# Altium project H21R4.PrjPcb
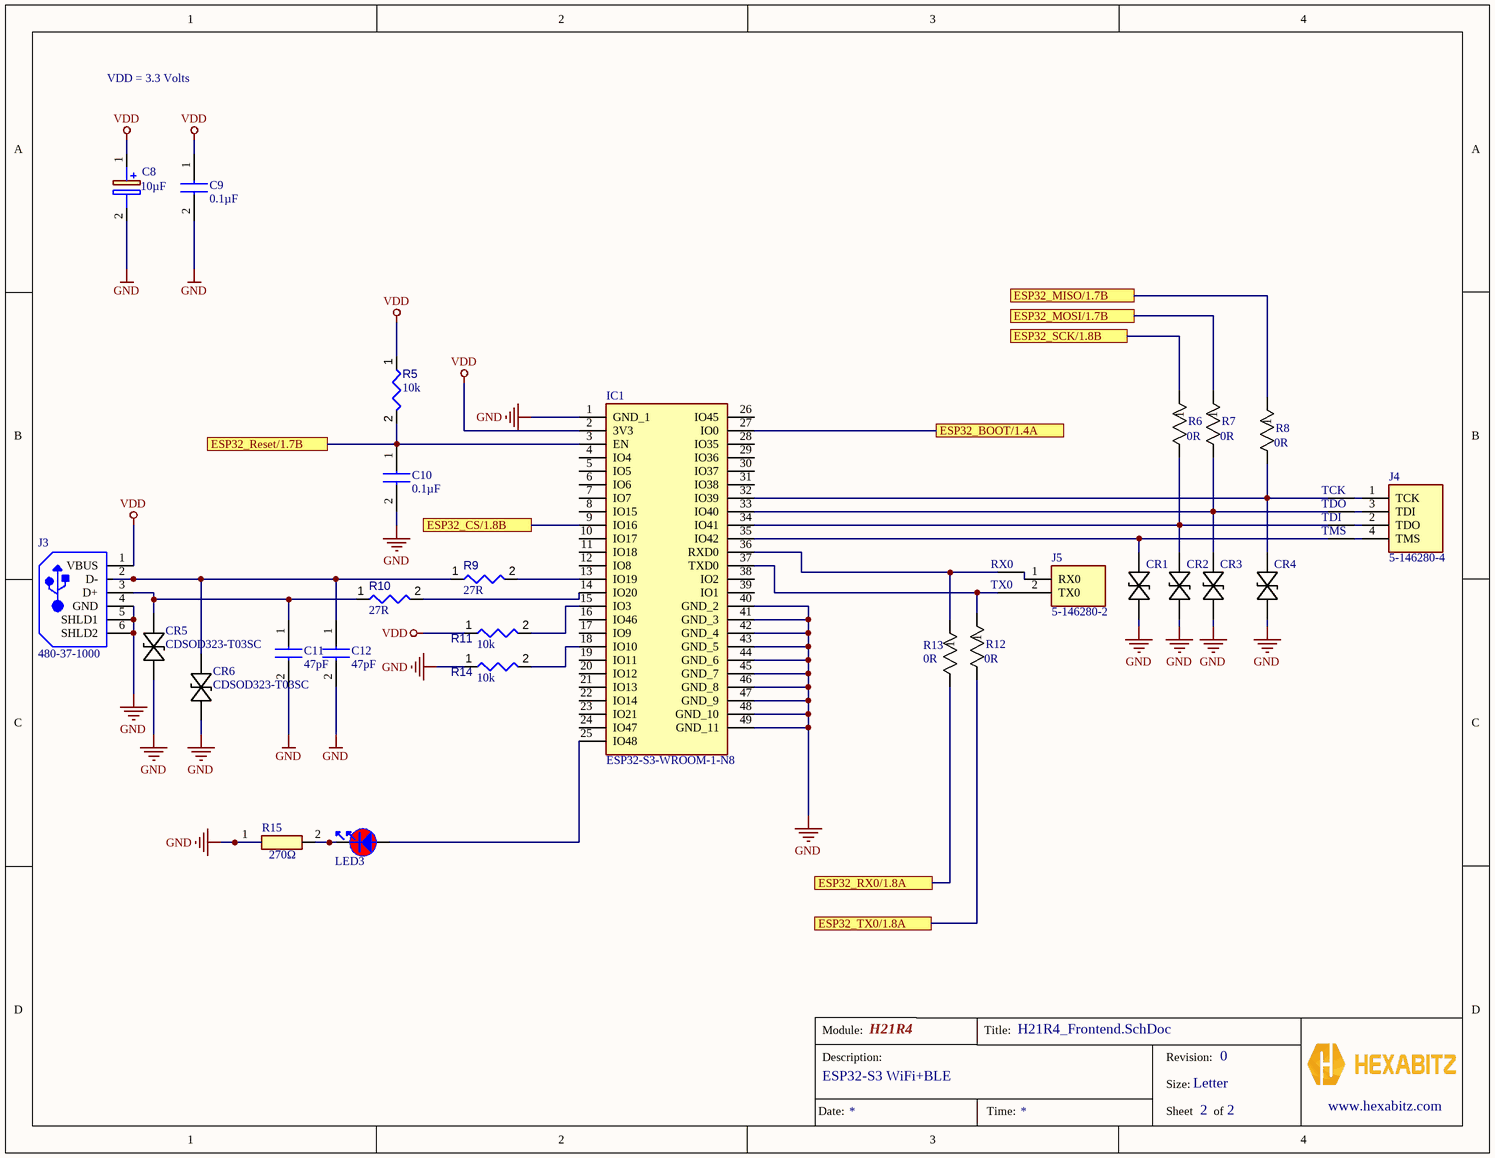
[diagram p0: H21R4_Frontend.SchDoc]
Module_Description: ESP32-S3 WiFi+BLE; Module_Name: H21R4; revision: 0
2 sheets, 73 parts. Net scope: flat (ports and power ports of the same name join across sheets).
Board file: H21R4.PcbDoc
Sheets:
  H21R4_Frontend.SchDoc
  H21R4_Backend.SchDoc

## Sheet H21R4_Frontend.SchDoc
size Letter; CompanyName: Hexabitz; DocumentNumber: 3; SheetNumber: 2; SheetTotal: 2

### Parts
C8  value 10µF  [CAPPM3528X210N]  (hidden comment: TPSB106K016R0500)
C9  value 0.1µF  [CAPC1608X87N]  (hidden comment: C0603C104K8RAC7867)
C10  value 0.1µF  [CAPC1608X87N]  (hidden comment: C0603C104K8RAC7867)
C11  value 47pF  [CAPC1608X90N]  (hidden comment: CL10C470JB8NNNC)
C12  value 47pF  [CAPC1608X90N]  (hidden comment: CL10C470JB8NNNC)
CR1  CDSOD323-T03SC  [SOD-323_BRN]  (value not drawn)
CR2  CDSOD323-T03SC  [SOD-323_BRN]  (value not drawn)
CR3  CDSOD323-T03SC  [SOD-323_BRN]  (value not drawn)
CR4  CDSOD323-T03SC  [SOD-323_BRN]  (value not drawn)
CR5  CDSOD323-T03SC  [SOD-323_BRN]
CR6  CDSOD323-T03SC  [SOD-323_BRN]
IC1  ESP32-S3-WROOM-1-N8  [ESP32S3WROOM1N8R2]
J3  480-37-1000  [MOLX-480-37-1000_V]
J4  5-146280-4  [HDRV4W77P254_4X1_467X488X821P]
J5  5-146280-2  [HDRV2W77P0X254_1X2_467X234X872P]
LED3  VLMS1300-GS08  [FP-6_541-5092_01-4-MFG]  (value not drawn)
R5  value 10k  [CAPC1508X06N]  (hidden comment: RMCF0603JT10K0)
R6  value 0R  [YAG_AC0402_YAG]  (hidden comment: AC0402JR-070RL)
R7  value 0R  [YAG_AC0402_YAG]  (hidden comment: AC0402JR-070RL)
R8  value 0R  [YAG_AC0402_YAG]  (hidden comment: AC0402JR-070RL)
R9  value 27R  [CAPC1608X06N]  (hidden comment: ERJ-3GEYJ270V)
R10  value 27R  [CAPC1608X06N]  (hidden comment: ERJ-3GEYJ270V)
R11  value 10k  [CAPC1508X06N]  (hidden comment: RMCF0603JT10K0)
R12  value 0R  [YAG_AC0402_YAG]  (hidden comment: AC0402JR-070RL)
R13  value 0R  [YAG_AC0402_YAG]  (hidden comment: AC0402JR-070RL)
R14  value 10k  [CAPC1508X06N]  (hidden comment: RMCF0603JT10K0)
R15  value 270Ω  [ERJ3EKF1000V]  (hidden comment: ERJ-3GEYJ271V)
RX0  HEXABIT_UART_PORT  [HEXABIT_POWER_PORT_U]  (value not drawn)  (no BOM)
TCK  HEXABIT_UART_PORT  [HEXABIT_POWER_PORT_U]  (value not drawn)  (no BOM)
TDI  HEXABIT_UART_PORT  [HEXABIT_POWER_PORT_U]  (value not drawn)  (no BOM)
TDO  HEXABIT_UART_PORT  [HEXABIT_POWER_PORT_U]  (value not drawn)  (no BOM)
TMS  HEXABIT_UART_PORT  [HEXABIT_POWER_PORT_U]  (value not drawn)  (no BOM)
TX0  HEXABIT_UART_PORT  [HEXABIT_POWER_PORT_U]  (value not drawn)  (no BOM)

### Ports
ESP32_BOOT/1.4A, ESP32_CS/1.8B, ESP32_MISO/1.7B, ESP32_MOSI/1.7B, ESP32_Reset/1.7B, ESP32_RX0/1.8A, ESP32_SCK/1.8B, ESP32_TX0/1.8A

### Nets
GND: C8.2(-) C9.2 C10.2 C11.2 C12.2 CR1.2(ANODECATHODE_2) CR2.2(ANODECATHODE_2) CR3.2(ANODECATHODE_2) CR4.2(ANODECATHODE_2) CR5.2(ANODECATHODE_2) CR6.2(ANODECATHODE_2) IC1.1(GND_1) IC1.27(IO0) IC1.40(GND_2) IC1.41(GND_3) IC1.42(GND_4) IC1.43(GND_5) IC1.44(GND_6) IC1.45(GND_7) IC1.46(GND_8) IC1.47(GND_9) IC1.48(GND_10) IC1.49(GND_11) J3.4(GND) J3.5(SHLD1) J3.6(SHLD2) R14.1 R15.1 ; port ESP32_BOOT/1.4A
VDD: C8.1(+) C9.1 IC1.2(3V3) J3.1(VBUS) R5.1 R11.1
UART3_RX: R12.2 ; port ESP32_TX0/1.8A
UART3_TX: R13.2 ; port ESP32_RX0/1.8A
NetC10_1: C10.1 IC1.3(EN) R5.2 ; port ESP32_Reset/1.7B
NetC11_1: C11.1 CR5.1(ANODECATHODE) J3.3(D+) R10.1
NetC12_1: C12.1 CR6.1(ANODECATHODE) J3.2(D-) R9.1
NetCR1_1: CR1.1(ANODECATHODE) IC1.35(IO42)
NetCR2_1: CR2.1(ANODECATHODE) IC1.34(IO41) R6.2
NetCR3_1: CR3.1(ANODECATHODE) IC1.33(IO40) R7.2
NetCR4_1: CR4.1(ANODECATHODE) IC1.32(IO39) R8.2
NetIC1_9: IC1.9(IO16) ; port ESP32_CS/1.8B
NetIC1_13: IC1.13(IO19) R9.2
NetIC1_14: IC1.14(IO20) R10.2
NetIC1_15: IC1.15(IO3) R11.2
NetIC1_18: IC1.18(IO10) R14.2
NetIC1_25: IC1.25(IO48) LED3.2
NetIC1_36: IC1.36(RXD0) R13.1
NetIC1_37: IC1.37(TXD0) R12.1
NetJ4_1: J4.1(TCK) TCK.Pwr_U
NetJ4_2: J4.2(TDO) TDI.Pwr_U
NetJ4_3: J4.3(TDI) TDO.Pwr_U
NetJ4_4: J4.4(TMS) TMS.Pwr_U
NetJ5_1: J5.1(RX0) RX0.Pwr_U
NetJ5_2: J5.2(TX0) TX0.Pwr_U
NetLED3_1: LED3.1 R15.2
NetR6_1: R6.1 ; port ESP32_SCK/1.8B
NetR7_1: R7.1 ; port ESP32_MOSI/1.7B
NetR8_1: R8.1 ; port ESP32_MISO/1.7B

Not connected (* = marked no-connect by the designer): IC1 4(IO4) 5(IO5) 6(IO6) 7(IO7) 8(IO15) 10(IO17) 11(IO18) 12(IO8) 16(IO46) 17(IO9) 19(IO11) 20(IO12) 21(IO13) 22(IO14) 23(IO21) 24(IO47) 26(IO45) 28(IO35) 29(IO36) 30(IO37) 31(IO38) 38(IO2) 39(IO1)

### Notes on the sheet
- VDD = 3.3 Volts
- Module:
- Title:
- Description:
- Size:
- Revision:
- Letter
- www.hexabitz.com
- Date:
- Time:
- Sheet
- of

### Library data of the parts
C8 = TPSB106K016R0500: Capacitor Polarised; Manufacturer_Name: Kyocera AVX; Datasheet Link: https://componentsearchengine.com/Datasheets/2/TPSB106K016R0500.pdf; Height: 2.1mm; Manufacturer_Part_Number: TPSB106K016R0500; Mouser Part Number: 581-TPSB106K016R0500; Mouser Price/Stock: https://www.mouser.co.uk/ProductDetail/KYOCERA-AVX/TPSB106K016R0500?qs=2Zc1E7vIw%252B6V4Ir4qQ11Ew%3D%3D; Arrow Part Number: TPSB106K016R0500; Arrow Price/Stock: https://www.arrow.com/en/products/tpsb106k016r0500/avx?utm_currency=USD&region=nac
C9 C10 = C0603C104K8RAC7867: Capacitor; Manufacturer_Name: KEMET; Datasheet Link: https://labcenter.componentsearchengine.com/Datasheets/1/C0603C104K8RAC7867.pdf; Height: 0.87mm; Manufacturer_Part_Number: C0603C104K8RAC7867; Mouser Part Number: N/A; Mouser Price/Stock: https://www.mouser.co.uk/ProductDetail/KEMET/C0603C104K8RAC7867?qs=DLNzJaHuXGcLxwK2qWBfDA%3D%3D; Arrow Part Number: C0603C104K8RAC7867; Arrow Price/Stock: https://www.arrow.com/en/products/c0603c104k8rac7867/kemet-corporation?region=nac
C11 C12 = CL10C470JB8NNNC: Capacitor; Manufacturer_Name: SAMSUNG; Datasheet Link: http://uk.rs-online.com/web/p/products/7665095; Height: 0.9mm; Manufacturer_Part_Number: CL10C470JB8NNNC; Mouser Part Number: 187-CL10C470JB8NNNC; Mouser Price/Stock: https://www.mouser.co.uk/ProductDetail/Samsung-Electro-Mechanics/CL10C470JB8NNNC?qs=349EhDEZ59pmluRkjzIjBw%3D%3D; Arrow Part Number: CL10C470JB8NNNC; Arrow Price/Stock: https://www.arrow.com/en/products/cl10c470jb8nnnc/samsung-electro-mechanics?region=nac
CR1-CR6 = CMP-009-000000-1: Description; Manufacturer_Name: Bourns Electronics; Design Item ID: CDSOD323-T03SC; Source: CDSOD323-T03SC.SchLib; Manufacturer_Part_Number: CDSOD323-T03SC; Copyright: Copyright (C) 2025 Ultra Librarian. All rights reserved.
IC1 = ESP32-S3-WROOM-1-N8: SMD MODULE, ESP32-S3, 8 MB SPI F; Manufacturer_Name: Espressif Systems; Datasheet Link: https://www.espressif.com/sites/default/files/documentation/esp32-s3-wroom-1_wroom-1u_datasheet_en.pdf; Height: 3.25mm; Manufacturer_Part_Number: ESP32-S3-WROOM-1-N8; Mouser Part Number: 356-ESP32-S3WROOM1N8; Mouser Price/Stock: https://www.mouser.co.uk/ProductDetail/Espressif-Systems/ESP32-S3-WROOM-1-N8?qs=Wj%2FVkw3K%252BMC1mq0KGPvoSQ%3D%3D
J3 = CMP-002-00040-2: Universal Serial Bus (USB) Shielded I/O Plug, Type A, Right Angle Connector, 4 Position, Height 4.6 mm, -20 to 85 degC, RoHS, Tray; Manufacturer: Molex; Gender: Male; Voltage Rating (AC): 150V; Max Current Rating: 1.5A; Package Description: 4-Pin Surface Mount Device, Body 12 x 18.8 mm; Max Operating Temperature: 85°C; Mounting Technology: SM; Contact Material: Brass; Case/Package: 480-37-1000; Connector Type: USB; Contact Plating: Gold; RoHS Compliant: True; Colour: Black; Datasheet URL: http://www.molex.com/pdm_docs/sd/480371000_sd.pdf; Manufacturer URL: http://www.molex.com/; Max Voltage Rating (AC): 150V; Datasheet Version: Rev. D, 06/2004; Current Rating: 1.5A; Min Operating Temperature: -20°C; Pins: 4; Package Reference: 480-37-1000; Packaging: Tray
J4 = CMP-002-00113-1: TE Connectivity Mod II Series, 2.54mm Pitch 4 Way 1 Row Straight PCB Header, Through Hole Termination; Geometry.Height: 8.21mm; Manufacturer_Name: TE Connectivity; Design Item ID: 5-146280-4; Source: 5-146280-4.SchLib; Newark Part Number: *; Datasheet Link: https://datasheet.datasheetarchive.com/originals/distributors/DKDS-20/396066.pdf; Manufacturer_Part_Number: 5-146280-4; Newark Price/Stock: *
J5 = CMP-057-000000-1: Body Features: Primary Product Color Black; Manufacturer_Name: TE Connectivity; Geometry.Height: 8.72mm; Datasheet Link: http://www.te.com/commerce/DocumentDelivery/DDEController?Action=showdoc&DocId=Customer+Drawing%7F146280%7FH2%7Fpdf%7FEnglish%7FENG_CD_146280_H2.pdf%7F5-146280-2; Arrow Price/Stock: https://www.arrow.com/en/products/5-146280-2/te-connectivity?utm_currency=USD&region=europe; Manufacturer_Part_Number: 5-146280-2; Design Item ID: 5-146280-2; Mouser Part Number: 571-5-146280-2; Mouser Price/Stock: https://www.mouser.co.uk/ProductDetail/TE-Connectivity/5-146280-2?qs=bwpFY26eRVcxHP%252BQexhLNQ%3D%3D; Arrow Part Number: 5-146280-2; Source: 5-146280-2.SchLib
LED3 = CMP-007-00039-1: LED Uni-Color Super Red 639nm 2-Pin Chip 0603(1608Metric) T/R; Manufacturer: Vishay Semiconductors; Lens Style: Rectangular,Clear; Forward Current: 20mA; Luminous Intensity: 54mcd; Number of LEDs: 1; Power Rating: 75mW; Library: Hexabitz; Dominant Wavelength: 631nm; Viewing Angle: 130°; Forward Voltage: 2V; Height: 0.8mm; Design Item ID: VLMS1300-GS08; ComponentLink3Description: https://datasheet.ciiva.com/9333/vlmo1300-9333743.pdf?src-supplier=Avnet; ComponentLink6URL: https://datasheet.ciiva.com/2114/vlmo1300-2114931.pdf?src-supplier=Digikey; Width: 0.8mm; Category: LEDs; ComponentLink1URL: https://datasheet.ciiva.com/26322/vlmo1300-26322153.pdf?src-supplier=Element14; ComponentLink3URL: https://datasheet.ciiva.com/9333/vlmo1300-9333743.pdf?src-supplier=Avnet; Lead Free: Lead Free; ComponentLink5Description: https://datasheet.ciiva.com/2114/vlmo1300-2114930.pdf?src-supplier=Digikey; ComponentLink7Description: https://datasheet.ciiva.com/2114/vlmo1300-2114929.pdf?src-supplier=Digikey; Min Operating Temperature: -35°C; Stock: 56745; Test Current: 20mA; Length: 1.6mm; Case Code (Metric): 1608; Series: CHipLED; Mounting Technology: Surface Mount; Color: Red; Manufacturer Part Number: VLMS1300-GS08; ComponentLink5URL: https://datasheet.ciiva.com/2114/vlmo1300-2114930.pdf?src-supplier=Digikey; Source: Semiconductor.SchLib; Radiation Hardening: No; ComponentLink7URL: https://datasheet.ciiva.com/2114/vlmo1300-2114929.pdf?src-supplier=Digikey; ComponentLink2URL: https://datasheet.ciiva.com/8028/vlmo1300-8028047.pdf?src-supplier=Element14; Pricing: 1=0.21, 10=0.143, 100=0.0998, 500=0.07982, 1000=0.07322 (USD); Wavelength: 631nm; Illumination Color: Red; ComponentLink6Description: https://datasheet.ciiva.com/2114/vlmo1300-2114931.pdf?src-supplier=Digikey; Case/Package: 0603; Reach SVHC Compliant: Unknown; RoHS Compliant: Yes; ComponentLink2Description: https://datasheet.ciiva.com/8028/vlmo1300-8028047.pdf?src-supplier=Element14; ComponentLink4URL: https://datasheet.ciiva.com/16510/vlmo1300-16510985.pdf?src-supplier=Future+Electronics; Max Operating Temperature: 85°C; Pins: 2; RoHS: Yes; ComponentLink1Description: https://datasheet.ciiva.com/26322/vlmo1300-26322153.pdf?src-supplier=Element14; ComponentLink4Description: https://datasheet.ciiva.com/16510/vlmo1300-16510985.pdf?src-supplier=Future+Electronics; Packaging: Tape and Reel; Component Type: Standard; Package Quantity: 1
R5 R11 R14 = CMP-009-00177-1: Res Thick Film 0603 10K Ohm 5% 1/10W ±200ppm/°C Molded SMD Paper T/R; Voltage Rating: 75V; Tolerance: 5%; Max Operating Temperature: 155°C; Min Operating Temperature: -55°C; Case/Package: 0603; Mounting Technology: Surface Mount
R6-R8 R12 R13 = CMP-009-00179-1: No Description Available; Manufacturer_Name: Yageo; Copyright: Copyright (C) 2025 Ultra Librarian. All rights reserved.; Manufacturer_Part_Number: AC0402JR-070RL; Source: AC0402JR-070RL.SchLib; Design Item ID: AC0402JR-070RL
R9 R10 = CMP-009-00178-1: Res Thick Film 0603 27 Ohm 5% 1/10W +/-200ppm/ßC Molded SMD Punched Carrier T/R; Voltage Rating: 75V; Mounting Technology: Surface Mount; Max Operating Temperature: 155°C; Case/Package: 0603; Tolerance: 5%; Min Operating Temperature: -55°C
R15 = ERJ-3GEYJ271V: Resistor; Manufacturer_Name: Panasonic; Datasheet Link: http://docs-europe.electrocomponents.com/webdocs/13ba/0900766b813ba21b.pdf; Height: 0.55mm; Manufacturer_Part_Number: ERJ-3GEYJ271V; Mouser Part Number: 667-ERJ-3GEYJ271V; Mouser Price/Stock: https://www.mouser.co.uk/ProductDetail/Panasonic/ERJ-3GEYJ271V?qs=gUVpg3Fu0g%2FL9W%252BXBtc%252BCA%3D%3D; Arrow Part Number: ERJ-3GEYJ271V; Arrow Price/Stock: https://www.arrow.com/en/products/erj-3geyj271v/panasonic?region=nac
RX0 TCK TDI TDO TMS TX0 = HEXABIT_POWER_PORT_U

## Sheet H21R4_Backend.SchDoc
size Letter; CompanyName: Hexabitz; DocumentNumber: 2; SheetNumber: 1; SheetTotal: 2
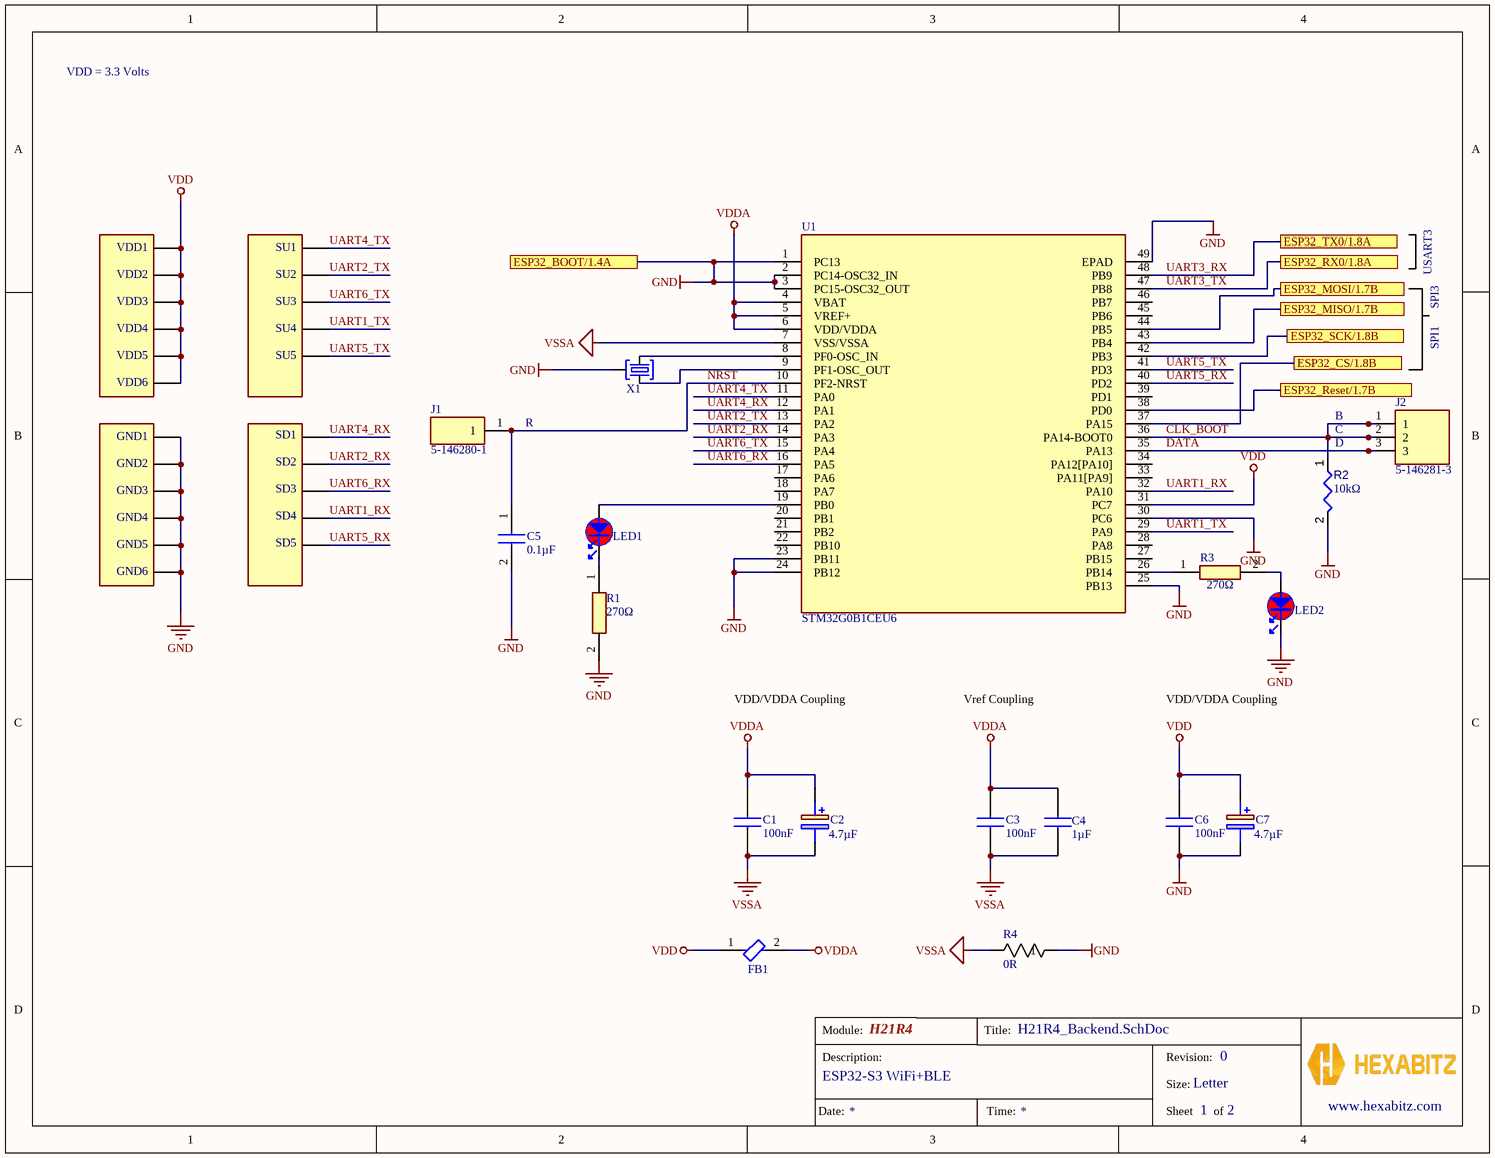
[diagram p1: H21R4_Backend.SchDoc]

### Parts
C1  value 100nF  [CAPC1608X87N]  (hidden comment: C0603C104K8RAC7867)
C2  value 4.7µF  [CAPPM2012X100N]  (hidden comment: 10TPU4R7MSI)
C3  value 100nF  [CAPC1608X87N]  (hidden comment: C0603C104K8RAC7867)
C4  value 1µF  [CAPC2012X145N]  (hidden comment: CC0805KKX7R7BB105)
C5  value 0.1µF  [CAPC1608X87N]  (hidden comment: C0603C104K8RAC7867)
C6  value 100nF  [CAPC1608X87N]  (hidden comment: C0603C104K8RAC7867)
C7  value 4.7µF  [CAPPM2012X100N]  (hidden comment: 10TPU4R7MSI)
FB1  MMZ1608Y300B  [FP-MMZ1608-0_8-MFG]  (value not drawn)
GND1  HEXABIT_UART_PORT  [HEXABIT_POWER_PORT_D]  (value not drawn)  (no BOM)
GND2  HEXABIT_UART_PORT  [HEXABIT_POWER_PORT_D]  (value not drawn)  (no BOM)
GND3  HEXABIT_UART_PORT  [HEXABIT_POWER_PORT_D]  (value not drawn)  (no BOM)
GND4  HEXABIT_UART_PORT  [HEXABIT_POWER_PORT_D]  (value not drawn)  (no BOM)
GND5  HEXABIT_UART_PORT  [HEXABIT_POWER_PORT_D]  (value not drawn)  (no BOM)
GND6  HEXABIT_UART_PORT  [HEXABIT_POWER_PORT_D]  (value not drawn)  (no BOM)
J1  5-146280-1  [HDRV1W67P0X254_1X1_213X234X821P]
J2  5-146281-3  [HDRV3W96P0X254_1X3_721X234X869P]
LED1  VLMS1300-GS08  [FP-6_541-5092_01-4-MFG]  (value not drawn)
LED2  VLMS1300-GS08  [FP-6_541-5092_01-4-MFG]  (value not drawn)
R1  value 270Ω  [ERJ3EKF1000V]  (hidden comment: ERJ-3GEYJ271V)
R2  value 10kΩ  [RESC1608X55X25ML10T15]  (hidden comment: Resistor 10k +/-1% 0603 100 mW)
R3  value 270Ω  [ERJ3EKF1000V]  (hidden comment: ERJ-3GEYJ271V)
R4  value 0R  [YAG_AC0402_YAG]  (hidden comment: AC0402JR-070RL)
SD1  HEXABIT_UART_PORT  [HEXABIT_UART_PORT_D]  (value not drawn)  (no BOM)
SD2  HEXABIT_UART_PORT  [HEXABIT_UART_PORT_D]  (value not drawn)  (no BOM)
SD3  HEXABIT_UART_PORT  [HEXABIT_UART_PORT_D]  (value not drawn)  (no BOM)
SD4  HEXABIT_UART_PORT  [HEXABIT_UART_PORT_D]  (value not drawn)  (no BOM)
SD5  HEXABIT_UART_PORT  [HEXABIT_UART_PORT_D]  (value not drawn)  (no BOM)
SU1  HEXABIT_UART_PORT  [HEXABIT_UART_PORT_U]  (value not drawn)  (no BOM)
SU2  HEXABIT_UART_PORT  [HEXABIT_UART_PORT_U]  (value not drawn)  (no BOM)
SU3  HEXABIT_UART_PORT  [HEXABIT_UART_PORT_U]  (value not drawn)  (no BOM)
SU4  HEXABIT_UART_PORT  [HEXABIT_UART_PORT_U]  (value not drawn)  (no BOM)
SU5  HEXABIT_UART_PORT  [HEXABIT_UART_PORT_U]  (value not drawn)  (no BOM)
U1  STM32G0B1CEU6  [QFN50P700X700X65-49N-D]
VDD1  HEXABIT_UART_PORT  [HEXABIT_POWER_PORT_U]  (value not drawn)  (no BOM)
VDD2  HEXABIT_UART_PORT  [HEXABIT_POWER_PORT_U]  (value not drawn)  (no BOM)
VDD3  HEXABIT_UART_PORT  [HEXABIT_POWER_PORT_U]  (value not drawn)  (no BOM)
VDD4  HEXABIT_UART_PORT  [HEXABIT_POWER_PORT_U]  (value not drawn)  (no BOM)
VDD5  HEXABIT_UART_PORT  [HEXABIT_POWER_PORT_U]  (value not drawn)  (no BOM)
VDD6  HEXABIT_UART_PORT  [HEXABIT_POWER_PORT_U]  (value not drawn)  (no BOM)
X1  CSTCE8M00G52Z-R0  [XTALL_CSTCE8M00G52]  (value not drawn)

### Ports
ESP32_BOOT/1.4A, ESP32_CS/1.8B, ESP32_MISO/1.7B, ESP32_MOSI/1.7B, ESP32_Reset/1.7B, ESP32_RX0/1.8A, ESP32_SCK/1.8B, ESP32_TX0/1.8A

### Nets
GND: C5.2 C6.1 C7.2(-) GND1.Pwr_D GND2.Pwr_D GND3.Pwr_D GND4.Pwr_D GND5.Pwr_D GND6.Pwr_D LED2.1 R1.2 R2.2 R4.1 U1.1(PC13) U1.2(PC14-OSC32_IN) U1.3(PC15-OSC32_OUT) U1.23(PB11) U1.24(PB12) U1.25(PB13) U1.30(PC6) U1.49(EPAD) X1.P$2 ; port ESP32_BOOT/1.4A
VDD: C6.2 C7.1(+) FB1.1 U1.31(PC7) VDD1.Pwr_U VDD2.Pwr_U VDD3.Pwr_U VDD4.Pwr_U VDD5.Pwr_U VDD6.Pwr_U
VDDA: C1.2 C2.1(+) C3.2 C4.1 FB1.2 U1.4(VBAT) U1.5(VREF+) U1.6(VDD/VDDA)
VSSA: C1.1 C2.2(-) C3.1 C4.2 R4.2 U1.7(VSS/VSSA)
CLK_BOOT: J2.1 J2.2 R2.1 U1.36(PA14-BOOT0)
DATA: J2.3 U1.35(PA13)
NRST: C5.1 J1.1 U1.10(PF2-NRST)
UART1_RX: SD4.UART_D U1.32(PA10)
UART1_TX: SU4.UART_U U1.29(PA9)
UART2_RX: SD2.UART_D U1.14(PA3)
UART2_TX: SU2.UART_U U1.13(PA2)
UART3_RX: U1.48(PB9) ; port ESP32_TX0/1.8A
UART3_TX: U1.47(PB8) ; port ESP32_RX0/1.8A
UART4_RX: SD1.UART_D U1.12(PA1)
UART4_TX: SU1.UART_U U1.11(PA0)
UART5_RX: SD5.UART_D U1.40(PD2)
UART5_TX: SU5.UART_U U1.41(PD3)
UART6_RX: SD3.UART_D U1.16(PA5)
UART6_TX: SU3.UART_U U1.15(PA4)
NetC10_1: U1.38(PD0) ; port ESP32_Reset/1.7B
NetIC1_9: U1.37(PA15) ; port ESP32_CS/1.8B
NetLED1_1: LED1.1 R1.1
NetLED1_2: LED1.2 U1.19(PB0)
NetLED2_2: LED2.2 R3.2
NetR3_1: R3.1 U1.26(PB14)
NetR6_1: U1.42(PB3) ; port ESP32_SCK/1.8B
NetR7_1: U1.44(PB5) ; port ESP32_MOSI/1.7B
NetR8_1: U1.43(PB4) ; port ESP32_MISO/1.7B
NetU1_8: U1.8(PF0-OSC_IN) X1.P$1
NetU1_9: U1.9(PF1-OSC_OUT) X1.P$3

Not connected (* = marked no-connect by the designer): U1 17(PA6) 18(PA7) 20(PB1) 21(PB2) 22(PB10) 27(PB15) 28(PA8) 33(PA11[PA9]) 34(PA12[PA10]) 39(PD1) 45(PB6) 46(PB7)

### Notes on the sheet
- VDD = 3.3 Volts
- USART3
- SPI3
- SPI1
- (near J1) R
- B
- C
- (near R2) D
- VDD/VDDA Coupling
- Vref Coupling
- Module:
- Title:
- Description:
- Size:
- Revision:
- Letter
- www.hexabitz.com
- Date:
- Time:
- Sheet
- of

### Library data of the parts
C1 C3 C6 = CMP-001-00141-1: Multilayer Ceramic Capacitors MLCC - SMD/SMT .1UF     10V   10%        0603; Manufacturer_Name: KEMET; Geometry.Height: 0.87mm; Design Item ID: C0603C104K8RAC7867; Source: C0603C104K8RAC7867.SchLib; Manufacturer_Part_Number: C0603C104K8RAC7867; Mouser Price/Stock: https://www.mouser.co.uk/ProductDetail/KEMET/C0603C104K8RAC7867?qs=DLNzJaHuXGcLxwK2qWBfDA%3D%3D; Arrow Price/Stock: https://www.arrow.com/en/products/c0603c104k8rac7867/kemet-corporation?region=nac; Arrow Part Number: C0603C104K8RAC7867; Datasheet Link: https://labcenter.componentsearchengine.com/Datasheets/1/C0603C104K8RAC7867.pdf; Mouser Part Number: N/A
C2 C7 = CMP-001-00143-1: Capacitor Tantalum TPU series 10V 4.7uF Panasonic 4.7uF 10 V dc Tantalum Capacitor Polymer Solid +/-20% tolerance POSCAP series; Geometry.Height: 1mm; Manufacturer_Part_Number: 10TPU4R7MSI; Datasheet Link: https://industrial.panasonic.com/cdbs/www-data/pdf/AAA8000/AAA8000C28.pdf; Manufacturer_Name: Panasonic; Arrow Price/Stock: https://www.arrow.com/en/products/10tpu4r7msi/panasonic; Arrow Part Number: 10TPU4R7MSI; Mouser Price/Stock: https://www.mouser.com/Search/Refine.aspx?Keyword=667-10TPU4R7MSI; Source: 10TPU4R7MSI.SchLib; Design Item ID: 10TPU4R7MSI; Mouser Part Number: 667-10TPU4R7MSI
C4 = CMP-001-00144-1: YAGEO - CC0805KKX7R7BB105 - SMD Multilayer Ceramic Capacitor, 1 F, 16 V, 0805 [2012 Metric], +/- 10%, X7R, CC Series; Geometry.Height: 1.45mm; Datasheet Link: https://4donline.ihs.com/images/VipMasterIC/IC/YAGO/YAGO-S-A0003557223/YAGO-S-A0003557223-1.pdf?hkey=6D3A4C79FDBF58556ACFDE234799DDF0; Mouser Price/Stock: https://www.mouser.co.uk/ProductDetail/YAGEO/CC0805KKX7R7BB105?qs=AgBp2OyFlx%2FM8WCHgVQGuw%3D%3D; Arrow Part Number: CC0805KKX7R7BB105; Manufacturer_Part_Number: CC0805KKX7R7BB105; Mouser Part Number: 603-CC805KKX7R7BB105; Design Item ID: CC0805KKX7R7BB105; Manufacturer_Name: YAGEO; Arrow Price/Stock: https://www.arrow.com/en/products/cc0805kkx7r7bb105/yageo?region=nac; Source: CC0805KKX7R7BB105.SchLib
C5 = C0603C104K8RAC7867: Capacitor; Manufacturer_Name: KEMET; Datasheet Link: https://labcenter.componentsearchengine.com/Datasheets/1/C0603C104K8RAC7867.pdf; Height: 0.87mm; Manufacturer_Part_Number: C0603C104K8RAC7867; Mouser Part Number: N/A; Mouser Price/Stock: https://www.mouser.co.uk/ProductDetail/KEMET/C0603C104K8RAC7867?qs=DLNzJaHuXGcLxwK2qWBfDA%3D%3D; Arrow Part Number: C0603C104K8RAC7867; Arrow Price/Stock: https://www.arrow.com/en/products/c0603c104k8rac7867/kemet-corporation?region=nac
FB1 = CMP-006-00027-1: Ferrite Beads 0603 30ohms 1500mA Signal Line AEC-Q200; Manufacturer Lifecycle Status: PRODUCTION; Manufacturer Part Number: MMZ1608Y300BTD25; Manufacturer: TDK; Max Current Rating: 1.5A; Number of Circuits: 1; Impedance: 30O; DC Resistance (DCR): 50mO; Test Frequency: 100MHz; Library: Hexabitz; Tolerance: 25%; ESR: 50m; Design Item ID: MMZ1608Y300B; RoHS: Compliant; Max Operating Temperature: 125°C; Case Code (Metric): 1608; Ratings: AEC-Q200; Termination: SMD/SMT; Pins: 2; Component Type: Standard; Stock: 11896; Min Operating Temperature: -55°C; Max Width: 950µm; Min Length: 1.45mm; Width: 800µm; Weight: 2.012816mg; ComponentLink2URL: https://datasheet.octopart.com:443/MMZ1608Y300BTD25-TDK-datasheet-151367874.pdf?src-supplier=TDK; Lifecycle Status: Production; Max Length: 1.75mm; Source: Passive.SchLib; Category: Ferrite Beads and Chips; Current Rating: 1.5A; Max DC Current: 1.5A; ComponentLink1URL: https://datasheet.octopart.com:443/MMZ1608Y300BTD25-TDK-datasheet-181268448.pdf?src-supplier=IHS; Case/Package: 0603; Number of Terminals: 2; REACH SVHC: Yes; Pricing: 1=0.1, 10=0.06, 25=0.052, 50=0.0468, 100=0.0419, 250=0.03612, 500=0.03214, 1000=0.02847 (USD); Core Material: Ferrite; RMS Current (Irms): 1.5A; Packaging: Tape & Reel (TR); Mounting Technology: Surface Mount; ComponentLink2Description: https://datasheet.octopart.com:443/MMZ1608Y300BTD25-TDK-datasheet-151367874.pdf?src-supplier=TDK; ComponentLink1Description: https://datasheet.octopart.com:443/MMZ1608Y300BTD25-TDK-datasheet-181268448.pdf?src-supplier=IHS; Number of Lines: 1; Length: 1.6mm; Min Width: 650µm; Height: 800µm
GND1-GND6 = HEXABIT_POWER_PORT_D
J1 = CMP-014-00004-1: AMP - TE CONNECTIVITY - 5-146280-1 - 01 MODII HDR SRST B/A LF; Geometry.Height: 8.21mm; Mouser Part Number: 571-51462801; Design Item ID: 5-146280-1; Arrow Price/Stock: https://www.arrow.com/en/products/5-146280-1/te-connectivity?region=nac; Datasheet Link: https://www.te.com/commerce/DocumentDelivery/DDEController?Action=showdoc&DocId=Customer+Drawing%7F146280%7FH2%7Fpdf%7FEnglish%7FENG_CD_146280_H2.pdf%7F5-146280-1; Manufacturer_Part_Number: 5-146280-1; Source: 5-146280-1.SchLib; Mouser Price/Stock: https://www.mouser.co.uk/ProductDetail/TE-Connectivity/5-146280-1?qs=bwpFY26eRVcArW7BMMLddw%3D%3D; Manufacturer_Name: TE Connectivity; Arrow Part Number: 5-146280-1
J2 = 5-146281-3: Connector; Manufacturer_Name: TE Connectivity; Datasheet Link: http://www.te.com/commerce/DocumentDelivery/DDEController?Action=showdoc&DocId=Customer+Drawing%7F146281%7FG2%7Fpdf%7FEnglish%7FENG_CD_146281_G2.pdf%7F5-146281-3; Height: 8.69mm; Manufacturer_Part_Number: 5-146281-3; Mouser Part Number: 571-5-146281-3; Mouser Price/Stock: https://www.mouser.co.uk/ProductDetail/TE-Connectivity/5-146281-3?qs=bwpFY26eRVc0RlLXOkMSNw%3D%3D; Arrow Part Number: 5-146281-3; Arrow Price/Stock: https://www.arrow.com/en/products/5-146281-3/te-connectivity?region=nac
LED1 LED2 = CMP-007-00039-1: as LED3 on sheet H21R4_Frontend; Height: 0.8mm; Design Item ID: VLMS1300-GS08; ComponentLink3Description: https://datasheet.ciiva.com/9333/vlmo1300-9333743.pdf?src-supplier=Avnet; ComponentLink6URL: https://datasheet.ciiva.com/2114/vlmo1300-2114931.pdf?src-supplier=Digikey; Width: 0.8mm; Category: LEDs; ComponentLink1URL: https://datasheet.ciiva.com/26322/vlmo1300-26322153.pdf?src-supplier=Element14; ComponentLink3URL: https://datasheet.ciiva.com/9333/vlmo1300-9333743.pdf?src-supplier=Avnet; Lead Free: Lead Free; ComponentLink5Description: https://datasheet.ciiva.com/2114/vlmo1300-2114930.pdf?src-supplier=Digikey; ComponentLink7Description: https://datasheet.ciiva.com/2114/vlmo1300-2114929.pdf?src-supplier=Digikey; Min Operating Temperature: -35°C; Stock: 56745; Test Current: 20mA; Length: 1.6mm; Case Code (Metric): 1608; Series: CHipLED; Mounting Technology: Surface Mount; Color: Red; Manufacturer Part Number: VLMS1300-GS08; ComponentLink5URL: https://datasheet.ciiva.com/2114/vlmo1300-2114930.pdf?src-supplier=Digikey; Source: Semiconductor.SchLib; Radiation Hardening: No; ComponentLink7URL: https://datasheet.ciiva.com/2114/vlmo1300-2114929.pdf?src-supplier=Digikey; ComponentLink2URL: https://datasheet.ciiva.com/8028/vlmo1300-8028047.pdf?src-supplier=Element14; Pricing: 1=0.21, 10=0.143, 100=0.0998, 500=0.07982, 1000=0.07322 (USD); Wavelength: 631nm; Illumination Color: Red; ComponentLink6Description: https://datasheet.ciiva.com/2114/vlmo1300-2114931.pdf?src-supplier=Digikey; Case/Package: 0603; Reach SVHC Compliant: Unknown; RoHS Compliant: Yes; ComponentLink2Description: https://datasheet.ciiva.com/8028/vlmo1300-8028047.pdf?src-supplier=Element14; ComponentLink4URL: https://datasheet.ciiva.com/16510/vlmo1300-16510985.pdf?src-supplier=Future+Electronics; Max Operating Temperature: 85°C; Pins: 2; RoHS: Yes; ComponentLink1Description: https://datasheet.ciiva.com/26322/vlmo1300-26322153.pdf?src-supplier=Element14; ComponentLink4Description: https://datasheet.ciiva.com/16510/vlmo1300-16510985.pdf?src-supplier=Future+Electronics; Packaging: Tape and Reel; Component Type: Standard; Package Quantity: 1
R1 R3 = ERJ-3GEYJ271V: Resistor; Manufacturer_Name: Panasonic; Datasheet Link: http://docs-europe.electrocomponents.com/webdocs/13ba/0900766b813ba21b.pdf; Height: 0.55mm; Manufacturer_Part_Number: ERJ-3GEYJ271V; Mouser Part Number: 667-ERJ-3GEYJ271V; Mouser Price/Stock: https://www.mouser.co.uk/ProductDetail/Panasonic/ERJ-3GEYJ271V?qs=gUVpg3Fu0g%2FL9W%252BXBtc%252BCA%3D%3D; Arrow Part Number: ERJ-3GEYJ271V; Arrow Price/Stock: https://www.arrow.com/en/products/erj-3geyj271v/panasonic?region=nac
R2 = CMP-009-00017-5: Chip Resistor, 10 KOhm, +/- 1%, 01 W, -55 to 155 degC, 0603 (1608 Metric); Voltage Rating: 50V; Power: 100mW; RoHS Compliant: True; Min Operating Temperature: -55°C; Pins: 2; Case/Package: 0603; Mounting Technology: SM; Max Operating Temperature: 155°C; Tolerance: 1%
R4 = CMP-009-00179-1: as R6 on sheet H21R4_Frontend; Copyright: Copyright (C) 2025 Ultra Librarian. All rights reserved.; Manufacturer_Part_Number: AC0402JR-070RL; Source: AC0402JR-070RL.SchLib; Design Item ID: AC0402JR-070RL
SD1-SD5 = HEXABIT_UART_PORT_D
SU1-SU5 = HEXABIT_UART_PORT_U
U1 = CMP-031-00010-1: MCU 32-bit ARM Cortex M0+ RISC 512KB Flash 1.8V/2.5V/3.3V 48-Pin UFQFPN EP Tray; Manufacturer: STMicroelectronics; Library: Hexabitz; RoHS: Yes; Source: ICs.SchLib; Category: Microcontrollers; Pricing: 1=4.78, 10=3.635, 25=3.3488, 100=3.0347, 260=2.87923, 520=2.7899, 1040=2.71638, 2600=2.63877 (USD); Design Item ID: STM32G0B1CEU6; Stock: 4305; Pins: 49; Manufacturer Part Number: STM32G0B1CEU6; Component Type: Standard
VDD1-VDD6 = HEXABIT_POWER_PORT_U
X1 = CMP-031-000013-1: Ceramic Resonator 8MHz ±0.5% (Tol) ±0.2% (Stability) 10pF 40Ohm 3-Pin CSMD T/R; Manufacturer: Murata; Library: Hexabitz; Impedance: 40R; Case Code (Metric): 3216; Max Operating Temperature: 125°C; Case/Package: 1206; Frequency Stability: 0.2%; Length: 3.2mm; Package Quantity: 1; Packaging: Tape and Reel; Contact Plating: Gold; Source: Passive.SchLib; Pin Count: 3; Manufacturer Part Number: CSTCE8M00G52Z-R0; Height: 0.031inch; RoHS Compliant: Yes; Frequency: 8MHz; Case Code (Imperial): 1206; Pins: 3; Value: 10pF; Series: CERALOCK®; Tolerance: 0.5%; Category: Capacitors; Load Capacitance: 10pF; Component Type: Standard; Width: 1.3mm; Termination: SMD/SMT; Design Item ID: CSTCE8M00G52Z-R0; Frequency Tolerance: 0.5%; Mounting Technology: Surface Mount; Min Operating Temperature: -40°C; Self Resonant Frequency: 8MHz

## Nets that join several sheets
GND: H21R4_Frontend (28 pins), H21R4_Backend (22 pins)
VDD: H21R4_Frontend (6 pins), H21R4_Backend (10 pins)
NetC10_1: H21R4_Frontend (C10.1 IC1.3 R5.2), H21R4_Backend (U1.38)
NetIC1_9: H21R4_Frontend (IC1.9), H21R4_Backend (U1.37)
NetR6_1: H21R4_Frontend (R6.1), H21R4_Backend (U1.42)
NetR7_1: H21R4_Frontend (R7.1), H21R4_Backend (U1.44)
NetR8_1: H21R4_Frontend (R8.1), H21R4_Backend (U1.43)
UART3_RX: H21R4_Frontend (R12.2), H21R4_Backend (U1.48)
UART3_TX: H21R4_Frontend (R13.2), H21R4_Backend (U1.47)